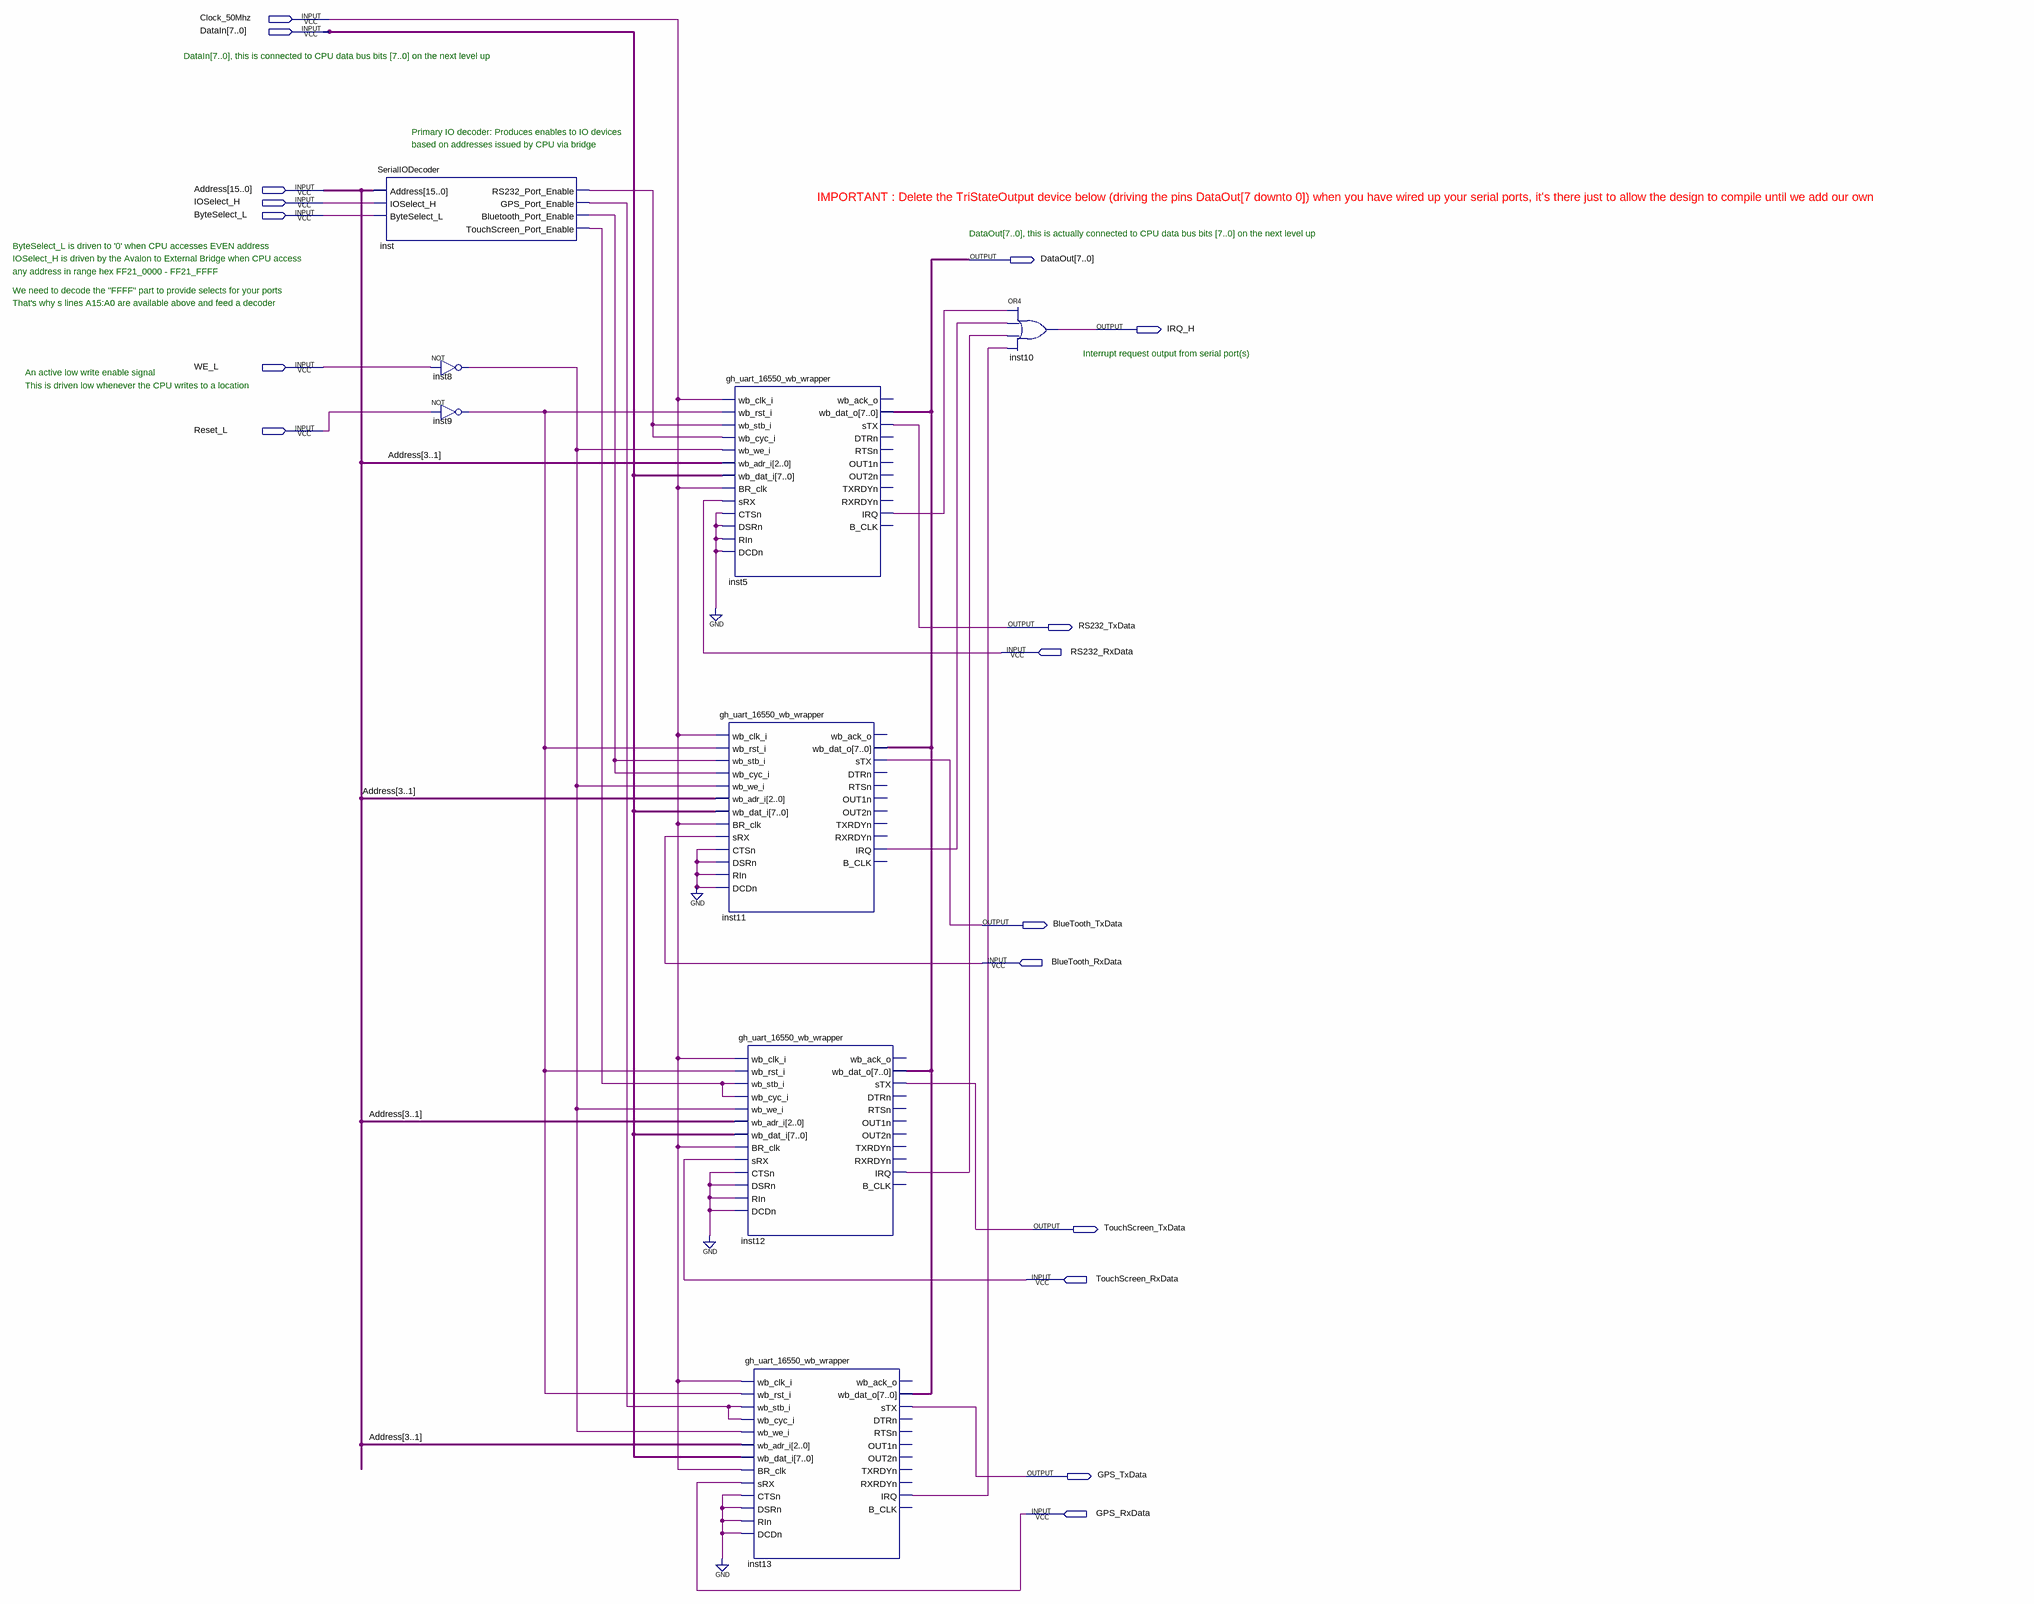
[diagram p0: schematic sheet]
// Quartus schematic OnChipSerialIO.bdf as structural Verilog: 8 symbols, 17 pins
module OnChipSerialIO (
  input  Clock_50Mhz,
  input  [7:0] DataIn,
  input  [15:0] Address,
  input  IOSelect_H,
  input  ByteSelect_L,
  input  WE_L,
  input  Reset_L,
  input  RS232_RxData,
  input  BlueTooth_RxData,
  input  TouchScreen_RxData,
  input  GPS_RxData,
  output [7:0] DataOut,
  output IRQ_H,
  output RS232_TxData,
  output BlueTooth_TxData,
  output TouchScreen_TxData,
  output GPS_TxData
);

  wire inst5_irq, inst8_out, inst9_out, inst11_irq, inst12_irq, inst13_irq, inst_bluetooth_port_enable,
       inst_gps_port_enable, inst_rs232_port_enable, inst_touchscreen_port_enable;

  SerialIODecoder inst (
    .Address(Address), .IOSelect_H(IOSelect_H), .ByteSelect_L(ByteSelect_L),
    .RS232_Port_Enable(inst_rs232_port_enable), .GPS_Port_Enable(inst_gps_port_enable),
    .Bluetooth_Port_Enable(inst_bluetooth_port_enable), .TouchScreen_Port_Enable(inst_touchscreen_port_enable));
  not inst8 (inst8_out, WE_L);
  not inst9 (inst9_out, Reset_L);
  gh_uart_16550_wb_wrapper inst5 (
    .wb_clk_i(Clock_50Mhz), .wb_rst_i(inst9_out), .wb_stb_i(inst_rs232_port_enable),
    .wb_cyc_i(inst_rs232_port_enable), .wb_we_i(inst8_out), .wb_adr_i(Address[3:1]), .wb_dat_i(DataIn),
    .BR_clk(Clock_50Mhz), .sRX(RS232_RxData), .CTSn(1'b0), .DSRn(1'b0), .RIn(1'b0), .DCDn(1'b0),
    .wb_dat_o(DataOut), .sTX(RS232_TxData), .IRQ(inst5_irq));  // open: wb_ack_o, DTRn, RTSn, OUT1n, OUT2n, TXRDYn, RXRDYn, B_CLK
  gh_uart_16550_wb_wrapper inst11 (
    .wb_clk_i(Clock_50Mhz), .wb_rst_i(inst9_out), .wb_stb_i(inst_bluetooth_port_enable),
    .wb_cyc_i(inst_bluetooth_port_enable), .wb_we_i(inst8_out), .wb_adr_i(Address[3:1]), .wb_dat_i(DataIn),
    .BR_clk(Clock_50Mhz), .sRX(BlueTooth_RxData), .CTSn(1'b0), .DSRn(1'b0), .RIn(1'b0), .DCDn(1'b0),
    .wb_dat_o(DataOut), .sTX(BlueTooth_TxData), .IRQ(inst11_irq));  // open: wb_ack_o, DTRn, RTSn, OUT1n, OUT2n, TXRDYn, RXRDYn, B_CLK
  gh_uart_16550_wb_wrapper inst12 (
    .wb_clk_i(Clock_50Mhz), .wb_rst_i(inst9_out), .wb_stb_i(inst_touchscreen_port_enable),
    .wb_cyc_i(inst_touchscreen_port_enable), .wb_we_i(inst8_out), .wb_adr_i(Address[3:1]), .wb_dat_i(DataIn),
    .BR_clk(Clock_50Mhz), .sRX(TouchScreen_RxData), .CTSn(1'b0), .DSRn(1'b0), .RIn(1'b0), .DCDn(1'b0),
    .wb_dat_o(DataOut), .sTX(TouchScreen_TxData), .IRQ(inst12_irq));  // open: wb_ack_o, DTRn, RTSn, OUT1n, OUT2n, TXRDYn, RXRDYn, B_CLK
  gh_uart_16550_wb_wrapper inst13 (
    .wb_clk_i(Clock_50Mhz), .wb_rst_i(inst9_out), .wb_stb_i(inst_gps_port_enable),
    .wb_cyc_i(inst_gps_port_enable), .wb_we_i(inst8_out), .wb_adr_i(Address[3:1]), .wb_dat_i(DataIn),
    .BR_clk(Clock_50Mhz), .sRX(GPS_RxData), .CTSn(1'b0), .DSRn(1'b0), .RIn(1'b0), .DCDn(1'b0),
    .wb_dat_o(DataOut), .sTX(GPS_TxData), .IRQ(inst13_irq));  // open: wb_ack_o, DTRn, RTSn, OUT1n, OUT2n, TXRDYn, RXRDYn, B_CLK
  or inst10 (IRQ_H, inst5_irq, inst11_irq, inst12_irq, inst13_irq);

  // Notes on the sheet:
  //   DataIn[7..0], this is connected to CPU data bus bits [7..0] on the next level up
  //   Primary IO decoder: Produces enables to IO devices
  //   based on addresses issued by CPU via bridge
  //   IMPORTANT : Delete the TriStateOutput device below (driving the pins DataOut[7 downto 0]) when you have wired up your serial ports, it's there just to allow the design to compile until we add our own
  //   DataOut[7..0], this is actually connected to CPU data bus bits [7..0] on the next level up
  //   ByteSelect_L is driven to '0' when CPU accesses EVEN address
  //   IOSelect_H is driven by the Avalon to External Bridge when CPU access
  //   any address in range hex FF21_0000 - FF21_FFFF
  //   We need to decode the "FFFF" part to provide selects for your ports 
  //   That's why s lines A15:A0 are available above and feed a decoder
  //   Interrupt request output from serial port(s)
  //   An active low write enable signal
  //   This is driven low whenever the CPU writes to a location
endmodule
